# EAGLE design Strain Gauge Amplifier (EAGLE 7.1.0)
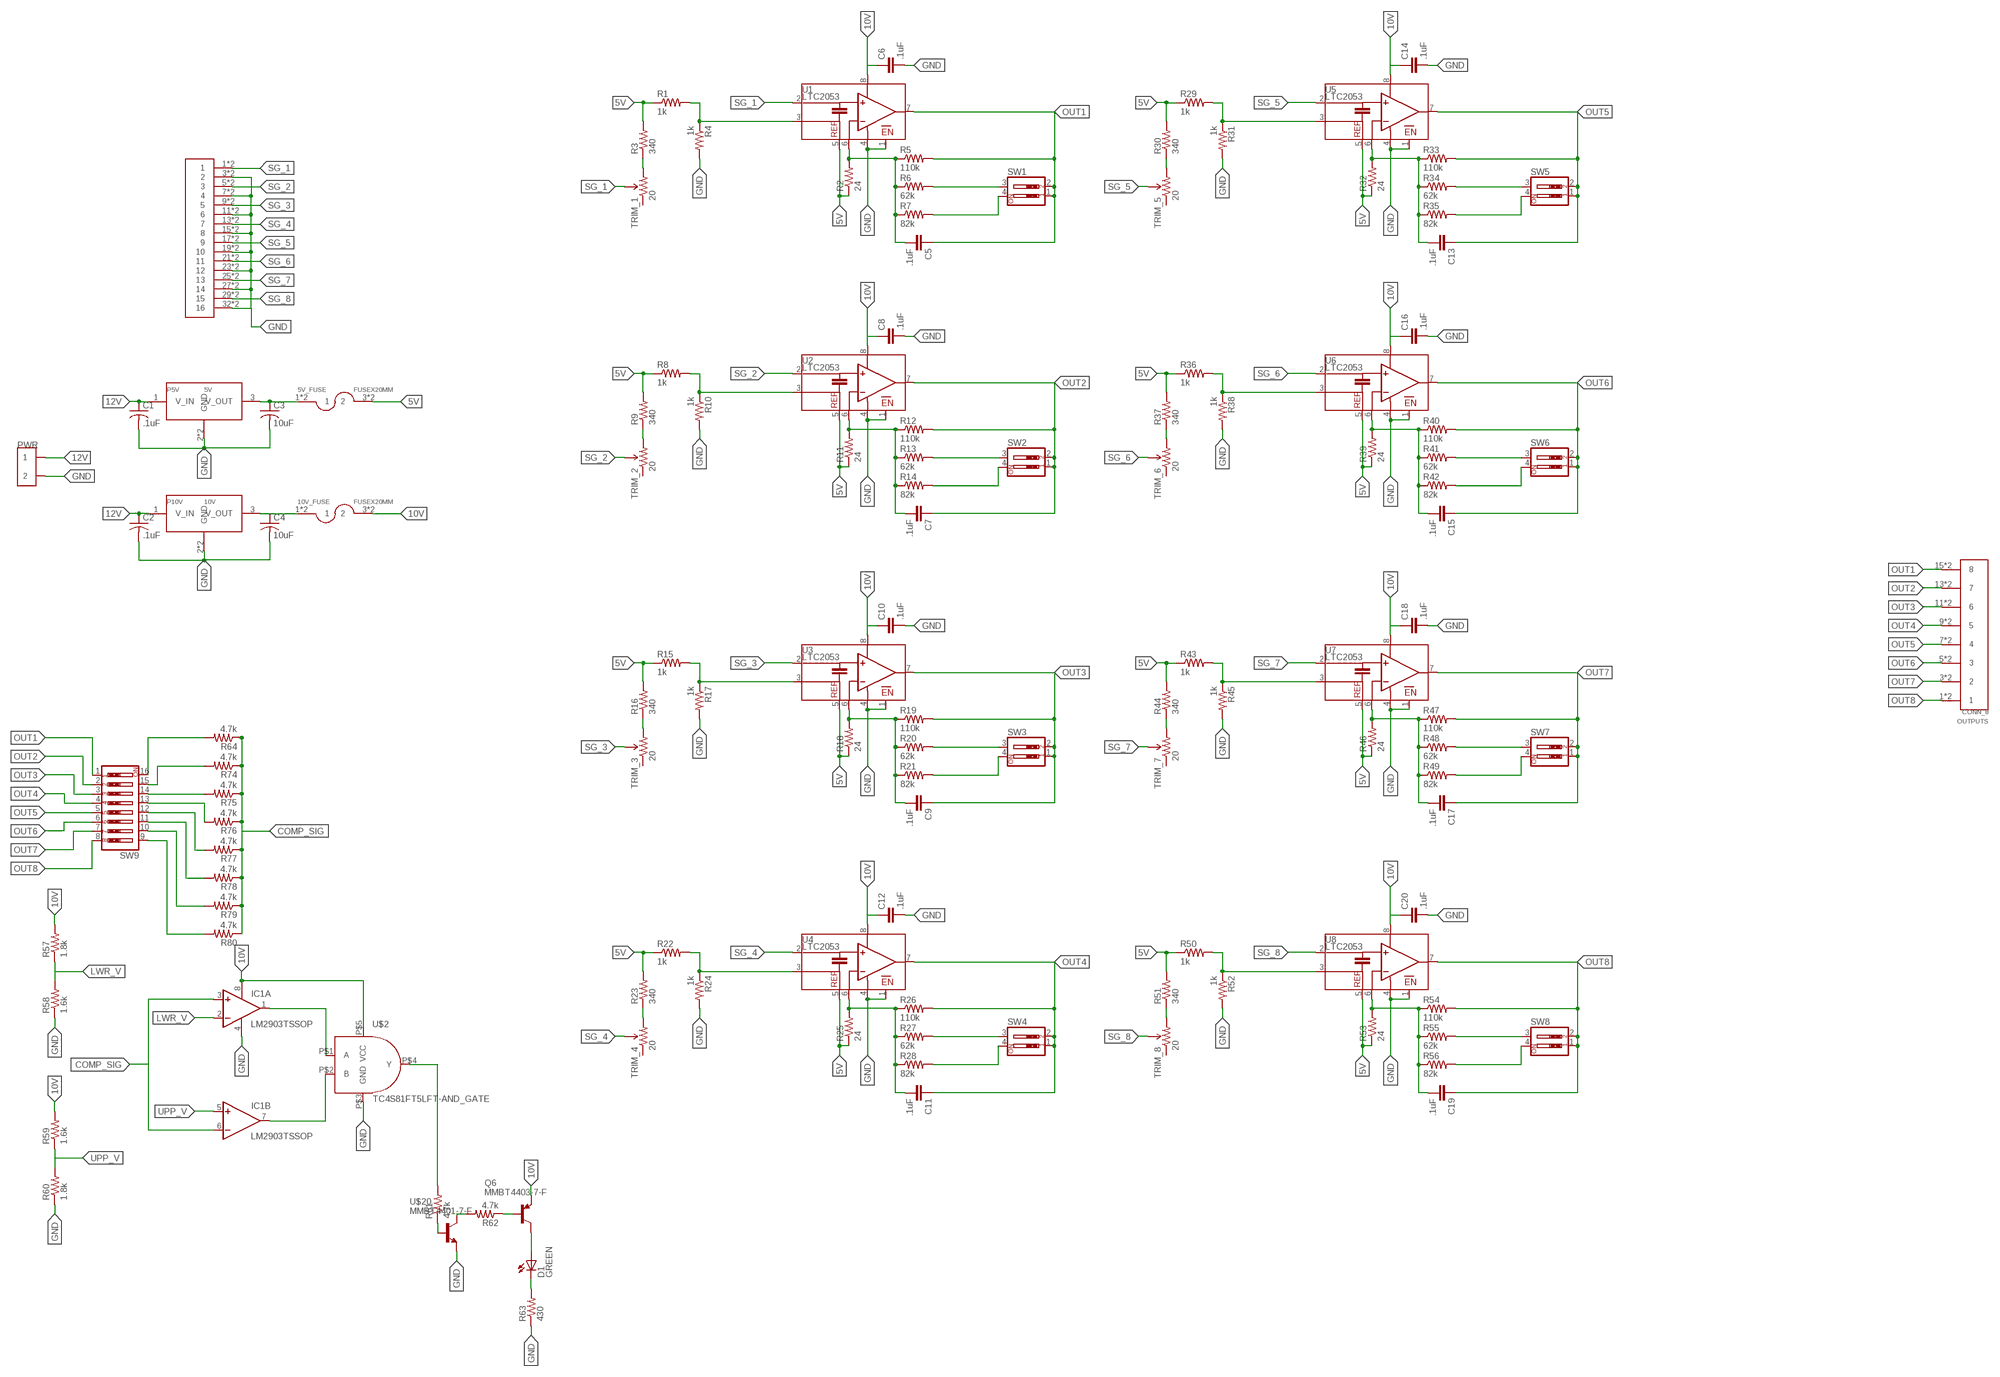
[diagram p0: schematic, sheet 1]

## Parts
5V_FUSE  FUSEX20MM  [FUSE_5MM]
10V_FUSE  FUSEX20MM  [FUSE_5MM]
C1  .1uF  C-USC0603  [C0603]
C2  .1uF  C-USC0603  [C0603]
C3  10uF  C-USC1206  [C1206]
C4  10uF  C-USC1206  [C1206]
C5  .1uF  CAP0603-CAP  [0603-CAP]
C6  .1uF  CAP0603-CAP  [0603-CAP]
C7  .1uF  CAP0603-CAP  [0603-CAP]
C8  .1uF  CAP0603-CAP  [0603-CAP]
C9  .1uF  CAP0603-CAP  [0603-CAP]
C10  .1uF  CAP0603-CAP  [0603-CAP]
C11  .1uF  CAP0603-CAP  [0603-CAP]
C12  .1uF  CAP0603-CAP  [0603-CAP]
C13  .1uF  CAP0603-CAP  [0603-CAP]
C14  .1uF  CAP0603-CAP  [0603-CAP]
C15  .1uF  CAP0603-CAP  [0603-CAP]
C16  .1uF  CAP0603-CAP  [0603-CAP]
C17  .1uF  CAP0603-CAP  [0603-CAP]
C18  .1uF  CAP0603-CAP  [0603-CAP]
C19  .1uF  CAP0603-CAP  [0603-CAP]
C20  .1uF  CAP0603-CAP  [0603-CAP]
D1  GREEN  LED-GREEN0603  [LED-0603]
IC1  LM2903TSSOP  [TSSOP8]
OUTPUTS  CONN_8  [CONNECTOR_8]
P5V  5V  LM2937  [SOT223]
P10V  10V  LM2937  [SOT223]
PWR  CONN_2  [CONNECTOR_2]
Q6  MMBT4403-7-F  [SOT-23-3]
R1  1k  RESISTOR0603  [0603-RES]
R2  24  RESISTOR0603  [0603-RES]
R3  340  RESISTOR0603  [0603-RES]
R4  1k  RESISTOR0603  [0603-RES]
R5  110k  RESISTOR0603  [0603-RES]
R6  62k  RESISTOR0603  [0603-RES]
R7  82k  RESISTOR0603  [0603-RES]
R8  1k  RESISTOR0603  [0603-RES]
R9  340  RESISTOR0603  [0603-RES]
R10  1k  RESISTOR0603  [0603-RES]
R11  24  RESISTOR0603  [0603-RES]
R12  110k  RESISTOR0603  [0603-RES]
R13  62k  RESISTOR0603  [0603-RES]
R14  82k  RESISTOR0603  [0603-RES]
R15  1k  RESISTOR0603  [0603-RES]
R16  340  RESISTOR0603  [0603-RES]
R17  1k  RESISTOR0603  [0603-RES]
R18  24  RESISTOR0603  [0603-RES]
R19  110k  RESISTOR0603  [0603-RES]
R20  62k  RESISTOR0603  [0603-RES]
R21  82k  RESISTOR0603  [0603-RES]
R22  1k  RESISTOR0603  [0603-RES]
R23  340  RESISTOR0603  [0603-RES]
R24  1k  RESISTOR0603  [0603-RES]
R25  24  RESISTOR0603  [0603-RES]
R26  110k  RESISTOR0603  [0603-RES]
R27  62k  RESISTOR0603  [0603-RES]
R28  82k  RESISTOR0603  [0603-RES]
R29  1k  RESISTOR0603  [0603-RES]
R30  340  RESISTOR0603  [0603-RES]
R31  1k  RESISTOR0603  [0603-RES]
R32  24  RESISTOR0603  [0603-RES]
R33  110k  RESISTOR0603  [0603-RES]
R34  62k  RESISTOR0603  [0603-RES]
R35  82k  RESISTOR0603  [0603-RES]
R36  1k  RESISTOR0603  [0603-RES]
R37  340  RESISTOR0603  [0603-RES]
R38  1k  RESISTOR0603  [0603-RES]
R39  24  RESISTOR0603  [0603-RES]
R40  110k  RESISTOR0603  [0603-RES]
R41  62k  RESISTOR0603  [0603-RES]
R42  82k  RESISTOR0603  [0603-RES]
R43  1k  RESISTOR0603  [0603-RES]
R44  340  RESISTOR0603  [0603-RES]
R45  1k  RESISTOR0603  [0603-RES]
R46  24  RESISTOR0603  [0603-RES]
R47  110k  RESISTOR0603  [0603-RES]
R48  62k  RESISTOR0603  [0603-RES]
R49  82k  RESISTOR0603  [0603-RES]
R50  1k  RESISTOR0603  [0603-RES]
R51  340  RESISTOR0603  [0603-RES]
R52  1k  RESISTOR0603  [0603-RES]
R53  24  RESISTOR0603  [0603-RES]
R54  110k  RESISTOR0603  [0603-RES]
R55  62k  RESISTOR0603  [0603-RES]
R56  82k  RESISTOR0603  [0603-RES]
R57  1.8k  RESISTOR0603  [0603-RES]
R58  1.6k  RESISTOR0603  [0603-RES]
R59  1.6k  RESISTOR0603  [0603-RES]
R60  1.8k  RESISTOR0603  [0603-RES]
R61  4.7k  RESISTOR0603  [0603-RES]
R62  4.7k  RESISTOR0603  [0603-RES]
R63  430  RESISTOR0603  [0603-RES]
R64  4.7k  RESISTOR0603  [0603-RES]
R74  4.7k  RESISTOR0603  [0603-RES]
R75  4.7k  RESISTOR0603  [0603-RES]
R76  4.7k  RESISTOR0603  [0603-RES]
R77  4.7k  RESISTOR0603  [0603-RES]
R78  4.7k  RESISTOR0603  [0603-RES]
R79  4.7k  RESISTOR0603  [0603-RES]
R80  4.7k  RESISTOR0603  [0603-RES]
SG_CONN  CONN_16  [CONNECTOR_16]
SW1  SW_DIP-2  [DIPSWITCH-02]
SW2  SW_DIP-2  [DIPSWITCH-02]
SW3  SW_DIP-2  [DIPSWITCH-02]
SW4  SW_DIP-2  [DIPSWITCH-02]
SW5  SW_DIP-2  [DIPSWITCH-02]
SW6  SW_DIP-2  [DIPSWITCH-02]
SW7  SW_DIP-2  [DIPSWITCH-02]
SW8  SW_DIP-2  [DIPSWITCH-02]
SW9  SW_DIP-8  [DIPSWITCH-08]
TRIM_1  20  3296Y  [3926_Y,Z]
TRIM_2  20  3296Y  [3926_Y,Z]
TRIM_3  20  3296Y  [3926_Y,Z]
TRIM_4  20  3296Y  [3926_Y,Z]
TRIM_5  20  3296Y  [3926_Y,Z]
TRIM_6  20  3296Y  [3926_Y,Z]
TRIM_7  20  3296Y  [3926_Y,Z]
TRIM_8  20  3296Y  [3926_Y,Z]
U1  LTC2053  [MSOP8]
U2  LTC2053  [MSOP8]
U3  LTC2053  [MSOP8]
U4  LTC2053  [MSOP8]
U5  LTC2053  [MSOP8]
U6  LTC2053  [MSOP8]
U7  LTC2053  [MSOP8]
U8  LTC2053  [MSOP8]
U$2  TC4S81FT5LFT-AND_GATE  [SSOP5-P-0.95]
U$20  MMBT4401-7-F  [SOT-23-3]

## Nets
5V: 5V_FUSE.3 5V_FUSE.4 R1.1 R2.1 R3.2 R8.1 R9.2 R11.1 R15.1 R16.2 R18.1 R22.1 R23.2 R25.1 R29.1 R30.2 R32.1 R36.1 R37.2 R39.1 R43.1 R44.2 R46.1 R50.1 R51.2 R53.1 U1.5(REF) U2.5(REF) U3.5(REF) U4.5(REF) U5.5(REF) U6.5(REF) U7.5(REF) U8.5(REF)
10V: 10V_FUSE.3 10V_FUSE.4 C6.1 C8.1 C10.1 C12.1 C14.1 C16.1 C18.1 C20.1 IC1.8(P:V+) Q6.P$3(E) R57.2 R59.2 U1.8(V+) U2.8(V+) U3.8(V+) U4.8(V+) U5.8(V+) U6.8(V+) U7.8(V+) U8.8(V+) U$2.P$5(VCC)
12V: C1.1 C2.1 P5V.1(V_IN) P10V.1(V_IN) PWR.1 PWR.2
COMP_SIG: IC1.3(A:+IN) IC1.6(B:-IN) R64.1 R74.1 R75.1 R76.1 R77.1 R78.1 R79.1 R80.1
GND: C1.2 C2.2 C3.2 C4.2 C6.2 C8.2 C10.2 C12.2 C14.2 C16.2 C18.2 C20.2 IC1.4(P:V-) P5V.2(GND) P5V.4(GND) P10V.2(GND) P10V.4(GND) PWR.3 PWR.4 R4.2 R10.2 R17.2 R24.2 R31.2 R38.2 R45.2 R52.2 R58.1 R60.1 R63.1 SG_CONN.3 SG_CONN.4 SG_CONN.7 SG_CONN.8 SG_CONN.11 SG_CONN.12 SG_CONN.15 SG_CONN.16 SG_CONN.19 SG_CONN.20 SG_CONN.23 SG_CONN.24 SG_CONN.27 SG_CONN.28 SG_CONN.32 SG_CONN.P31 U1.1(EN) U1.4(V-) U2.1(EN) U2.4(V-) U3.1(EN) U3.4(V-) U4.1(EN) U4.4(V-) U5.1(EN) U5.4(V-) U6.1(EN) U6.4(V-) U7.1(EN) U7.4(V-) U8.1(EN) U8.4(V-) U$2.P$3(GND) U$20.P$3(E)
LWR_V: IC1.2(A:-IN) R57.1 R58.2
N$1: C5.2 R2.2 R5.1 R6.1 R7.1 U1.6(RG)
N$2: 5V_FUSE.1 5V_FUSE.2 C3.1 P5V.3(V_OUT)
N$3: 10V_FUSE.1 10V_FUSE.2 C4.1 P10V.3(V_OUT)
N$4: R1.2 R4.1 U1.3(+IN)
N$5: IC1.1(A:OUT) U$2.P$1(A)
N$6: R3.1 TRIM_1.3(CW)
N$7: R6.2 SW1.3
N$8: R7.2 SW1.4
N$9: R8.2 R10.1 U2.3(+IN)
N$10: C7.2 R11.2 R12.1 R13.1 R14.1 U2.6(RG)
N$11: IC1.7(B:OUT) U$2.P$2(B)
N$12: R9.1 TRIM_2.3(CW)
N$13: R13.2 SW2.3
N$14: R14.2 SW2.4
N$15: R15.2 R17.1 U3.3(+IN)
N$16: C9.2 R18.2 R19.1 R20.1 R21.1 U3.6(RG)
N$17: R61.1 U$20.P$2(B)
N$18: R16.1 TRIM_3.3(CW)
N$19: R20.2 SW3.3
N$20: R21.2 SW3.4
N$21: R22.2 R24.1 U4.3(+IN)
N$22: C11.2 R25.2 R26.1 R27.1 R28.1 U4.6(RG)
N$23: R62.2 U$20.P$1(C)
N$24: R23.1 TRIM_4.3(CW)
N$25: R27.2 SW4.3
N$26: R28.2 SW4.4
N$27: R29.2 R31.1 U5.3(+IN)
N$28: C13.2 R32.2 R33.1 R34.1 R35.1 U5.6(RG)
N$29: Q6.P$2(B) R62.1
N$30: R30.1 TRIM_5.3(CW)
N$31: R34.2 SW5.3
N$32: R35.2 SW5.4
N$33: R36.2 R38.1 U6.3(+IN)
N$34: C15.2 R39.2 R40.1 R41.1 R42.1 U6.6(RG)
N$35: R61.2 U$2.P$4(Y)
N$36: R37.1 TRIM_6.3(CW)
N$37: R41.2 SW6.3
N$38: R42.2 SW6.4
N$39: R43.2 R45.1 U7.3(+IN)
N$40: C17.2 R46.2 R47.1 R48.1 R49.1 U7.6(RG)
N$41: D1.A Q6.P$1(C)
N$42: R44.1 TRIM_7.3(CW)
N$43: R48.2 SW7.3
N$44: R49.2 SW7.4
N$45: R50.2 R52.1 U8.3(+IN)
N$46: C19.2 R53.2 R54.1 R55.1 R56.1 U8.6(RG)
N$47: D1.C R63.2
N$48: R51.1 TRIM_8.3(CW)
N$49: R55.2 SW8.3
N$50: R56.2 SW8.4
N$65: R64.2 SW9.16
N$66: R74.2 SW9.15
N$67: R75.2 SW9.14
N$68: R76.2 SW9.13
N$69: R77.2 SW9.12
N$70: R78.2 SW9.11
N$73: R79.2 SW9.10
N$74: R80.2 SW9.9
OUT1: C5.1 OUTPUTS.15 OUTPUTS.16 R5.2 SW1.1 SW1.2 SW9.1 U1.7(OUT)
OUT2: C7.1 OUTPUTS.13 OUTPUTS.14 R12.2 SW2.1 SW2.2 SW9.2 U2.7(OUT)
OUT3: C9.1 OUTPUTS.11 OUTPUTS.12 R19.2 SW3.1 SW3.2 SW9.3 U3.7(OUT)
OUT4: C11.1 OUTPUTS.9 OUTPUTS.10 R26.2 SW4.1 SW4.2 SW9.4 U4.7(OUT)
OUT5: C13.1 OUTPUTS.7 OUTPUTS.8 R33.2 SW5.1 SW5.2 SW9.5 U5.7(OUT)
OUT6: C15.1 OUTPUTS.5 OUTPUTS.6 R40.2 SW6.1 SW6.2 SW9.6 U6.7(OUT)
OUT7: C17.1 OUTPUTS.3 OUTPUTS.4 R47.2 SW7.1 SW7.2 SW9.7 U7.7(OUT)
OUT8: C19.1 OUTPUTS.1 OUTPUTS.2 R54.2 SW8.1 SW8.2 SW9.8 U8.7(OUT)
SG_1: SG_CONN.1 SG_CONN.2 TRIM_1.2(WIPER) U1.2(-IN)
SG_2: SG_CONN.5 SG_CONN.6 TRIM_2.2(WIPER) U2.2(-IN)
SG_3: SG_CONN.9 SG_CONN.10 TRIM_3.2(WIPER) U3.2(-IN)
SG_4: SG_CONN.13 SG_CONN.14 TRIM_4.2(WIPER) U4.2(-IN)
SG_5: SG_CONN.17 SG_CONN.18 TRIM_5.2(WIPER) U5.2(-IN)
SG_6: SG_CONN.21 SG_CONN.22 TRIM_6.2(WIPER) U6.2(-IN)
SG_7: SG_CONN.25 SG_CONN.26 TRIM_7.2(WIPER) U7.2(-IN)
SG_8: SG_CONN.29 SG_CONN.30 TRIM_8.2(WIPER) U8.2(-IN)
UPP_V: IC1.5(B:+IN) R59.1 R60.2
Unconnected: TRIM_1.1(CCW) TRIM_2.1(CCW) TRIM_3.1(CCW) TRIM_4.1(CCW) TRIM_5.1(CCW) TRIM_6.1(CCW) TRIM_7.1(CCW) TRIM_8.1(CCW)

## Library data of the parts
5V_FUSE 10V_FUSE = SparkFun-Passives:FUSE
C1-C4 = resistor:C-US: CAPACITOR, American symbol
C5-C20 = SparkFun-Passives:CAP: Capacitor Standard 0603 ceramic capacitor, and 0.1" leaded capacitor.
D1 = SparkFun-LED:LED-GREEN: Various green LEDs 0603- DIO-00821 LARGE- DIO-00862 LILYPAD- DIO-09910; PROD_ID: DIO-00821
IC1 = linear:LM2903: COMPARATOR
OUTPUTS = formula electric:CONN_8
P5V P10V = texas:LM2937
PWR = formula electric:CONN_2
Q6 = formula electric:MMBT4403-7-F
R1-R64 R74-R80 = SparkFun-Resistors:RESISTOR: Resistor Basic schematic elements and footprints for 0603, 1206, and PTH resistors.
SG_CONN = formula electric:CONN_16
SW1-SW8 = SparkFun-Electromechanical:SW_DIP-2: DIP SWITCH
SW9 = SparkFun-Electromechanical:SW_DIP-8: DIP Switch 8 Position Spark Fun Electronics SKU : COM-08034
TRIM_1-TRIM_8 = bourns:3296Y: Trimpot
U1-U8 = linear-technology:LTC2053: DK: LTC2053CMS8#PBF-ND
U$2 = formula electric:TC4S81FT5LFT-AND_GATE: TC4S81FT5LFTCT-ND
U$20 = formula electric:MMBT4401-7-F

## Board
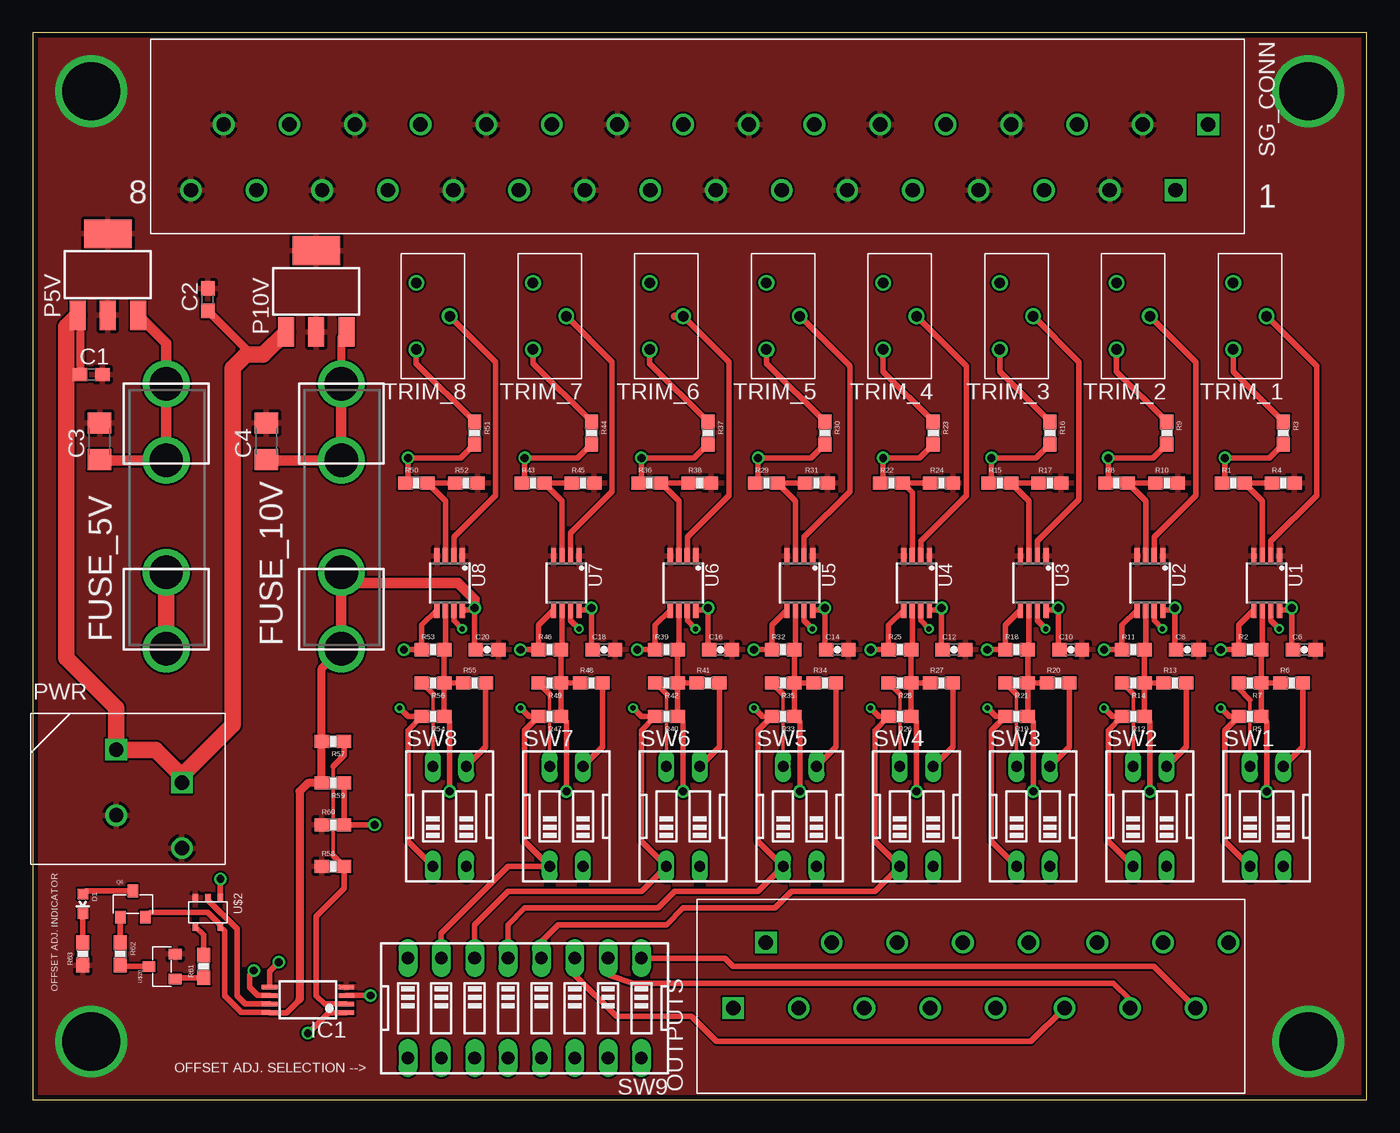
[diagram p1: board, top side]
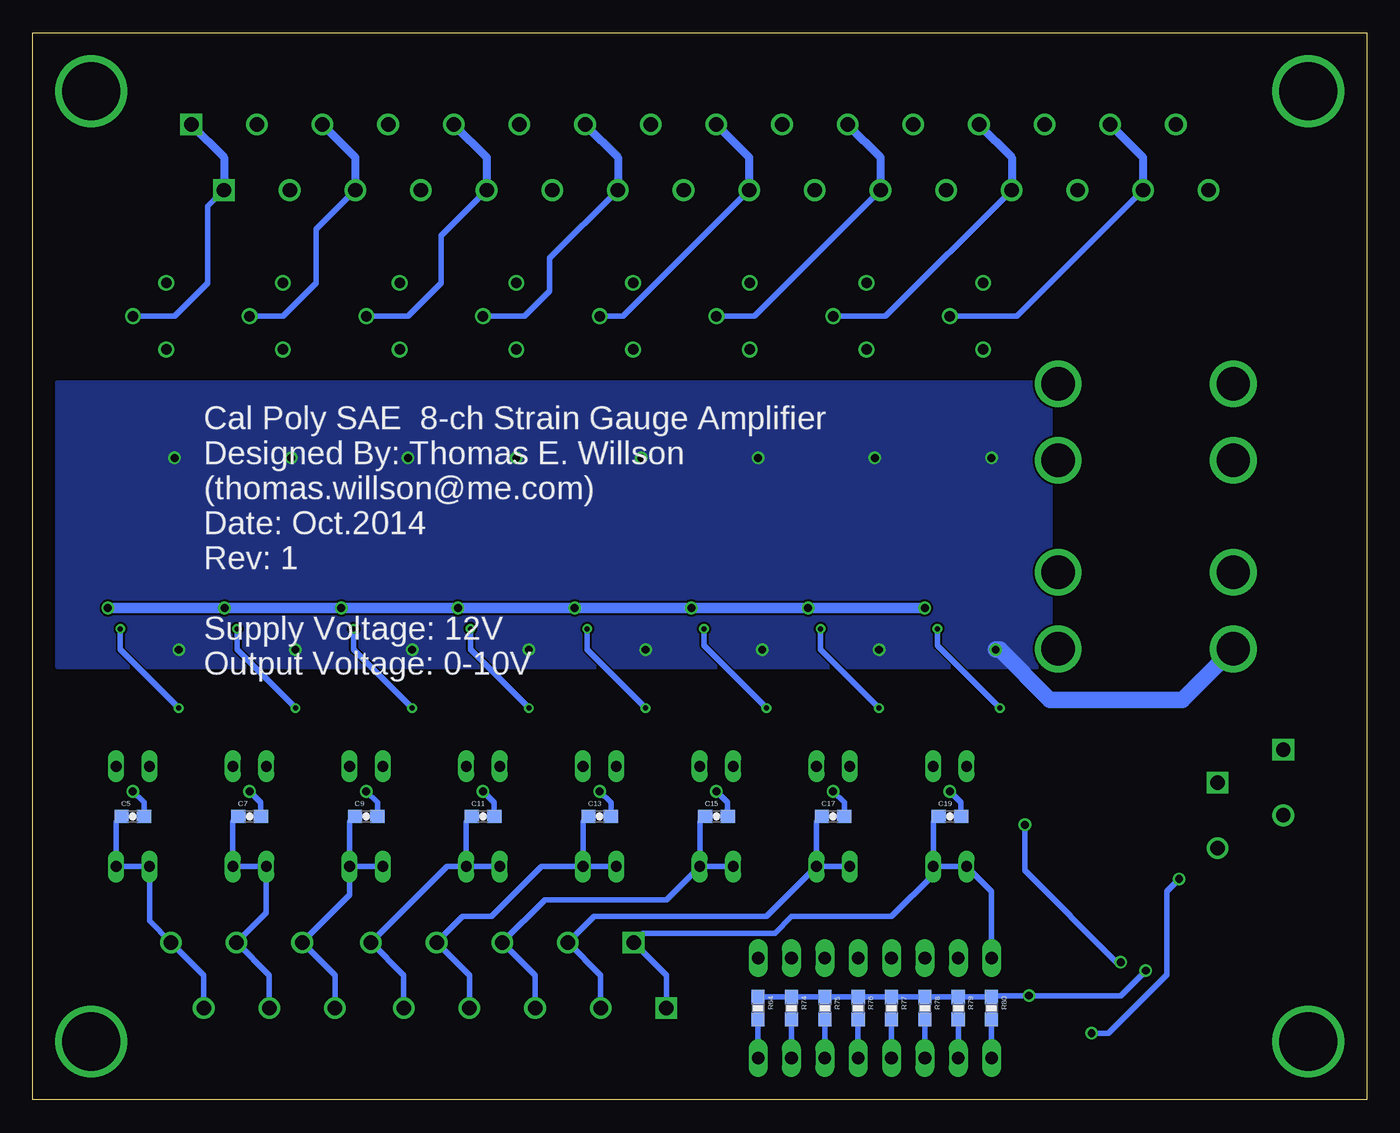
[diagram p2: board, bottom side, seen from below]

Size 101.6 x 81.28 mm. Coordinates in mm from the lower left corner, seen from the top.
Outline: 0,0 101.6,0 101.6,81.28 0,81.28 0,0
Copper layers (1*16): Top 0.0356mm / dielectric 1.5011mm / Bottom 0.0356mm
Design rules "OshPark DRC *": minimum track width 6mil, minimum drill 13mil, track to track 6mil, track to pad 6mil, pad to pad 6mil, via to via 6mil, smd to smd 6mil, copper to edge 15mil, drill to drill 6mil, minimum pad ring 7mil, minimum via ring 7mil, stop-mask expansion 3mil, vias tented up to drill 25mil, thermal gap 10mil

### Footprints (pad centres in the part's own frame; a part is rotated, then mirrored left to right if it is on the bottom)
FUSE_5MM = drill 2.54 pad 3.556: 1 0,-10.1; 2 0,-4.258; 3 0,4.258; 4 0,10.1
C0603 = smd 1.1 x 1: 1 -0.85,0; 2 0.85,0
C1206 = smd 1.6 x 1.8: 1 -1.4,0; 2 1.4,0
0603-CAP = smd 1.1 x 1: 1 -0.85,0; 2 0.85,0
LED-0603 = smd 0.8 x 0.8: A 0,-0.75; C 0,0.75
TSSOP8 = smd 0.35 x 1.2: 1 -0.975,-2.925; 2 -0.325,-2.925; 3 0.325,-2.925; 4 0.975,-2.925; 5 0.975,2.925; 6 0.325,2.925; 7 -0.325,2.925; 8 -0.975,2.925
CONNECTOR_8 = drill 1.1 square: 1 -2.54,-5.08; 2 -0.04,-0.08 | drill 1.1: 3 2.46,-5.08; 4 4.96,-0.08; 5 7.46,-5.08; 6 9.96,-0.08; 7 12.46,-5.08; 8 14.96,-0.08; 9 17.46,-5.08; 10 19.96,-0.08; 11 22.7,-5.08; 12 25.2,-0.08; 13 27.7,-5.08; 14 30.2,-0.08; 15 32.7,-5.08; 16 35.2,-0.08
SOT223 = smd 1.219 x 2.235: 1 -2.311,-3.099; 2 0,-3.099; 3 2.311,-3.099 | smd 3.6 x 2.2: 4 0,3.099
CONNECTOR_2 = drill 1.1 square: 1 0,0; 2 2.5,5 | drill 1.1: 3 5,0; 4 7.5,5
SOT-23-3 = smd 0.8 x 0.976: P$1 0,1; P$2 -0.95,-1; P$3 0.95,-1
0603-RES = smd 1.1 x 1: 1 -0.85,0; 2 0.85,0
CONNECTOR_16 = drill 1.1 square: 1 0,0; 2 2.5,5 | drill 1.1: 3 5,0; 4 7.5,5; 5 10,0; 6 12.5,5; 7 15,0; 8 17.5,5; 9 20,0; 10 22.5,5; 11 25,0; 12 27.5,5; 13 30,0; 14 32.5,5; 15 35,0; 16 37.5,5; 17 40,0; 18 42.5,5; 19 45,0; 20 47.5,5; 21 50,0; 22 52.5,5; 23 55,0; 24 57.5,5; 25 60,0; 26 62.5,5; 27 65,0; 28 67.5,5; 29 70,0; 30 72.5,5; 32 77.5,5; P31 75,0
DIPSWITCH-02 = drill 0.813 long: 1 -1.27,-3.81; 2 1.27,-3.81; 3 1.27,3.81; 4 -1.27,3.81
DIPSWITCH-08 = drill 0.97 long: 1 -8.89,-3.81; 2 -6.35,-3.81; 3 -3.81,-3.81; 4 -1.27,-3.81; 5 1.27,-3.81; 6 3.81,-3.81; 7 6.35,-3.81; 8 8.89,-3.81; 9 8.89,3.81; 10 6.35,3.81; 11 3.81,3.81; 12 1.27,3.81; 13 -1.27,3.81; 14 -3.81,3.81; 15 -6.35,3.81; 16 -8.89,3.81
3926_Y,Z = drill 0.8: 1 1.27,-2.54; 2 -1.27,0; 3 1.27,2.54
MSOP8 = smd 0.4 x 1.2: 1 -0.975,-2.05; 2 -0.325,-2.05; 3 0.325,-2.05; 4 0.975,-2.05; 5 0.975,2.05; 6 0.325,2.05; 7 -0.325,2.05; 8 -0.975,2.05
SSOP5-P-0.95 = smd 0.6 x 0.4: P$1 -1.1,0.95; P$2 -1.1,0; P$3 -1.1,-0.95; P$4 1.1,-0.95; P$5 1.1,0.95

### Placement (x,y rotation side)
5V_FUSE  10.16,44.45 180 top
10V_FUSE  23.5,44.45 180 top
C1  4.45,55.24 0 top
C2  13.34,60.96 90 top
C3  5.08,50.16 90 top
C4  17.78,50.16 90 top
C5  93.98,21.59 0 bottom
C6  96.84,34.29 0 top
C7  85.09,21.59 0 bottom
C8  87.95,34.29 0 top
C9  76.2,21.59 0 bottom
C10  79.06,34.29 0 top
C11  67.31,21.59 0 bottom
C12  70.17,34.29 0 top
C13  58.42,21.59 0 bottom
C14  61.28,34.29 0 top
C15  49.53,21.59 0 bottom
C16  52.39,34.29 0 top
C17  40.64,21.59 0 bottom
C18  43.5,34.29 0 top
C19  31.75,21.59 0 bottom
C20  34.61,34.29 0 top
D1  3.81,14.92 180 top
IC1  20.95,7.62 90 top
OUTPUTS  55.88,12.06 0 top
P5V  5.71,62.87 0 top
P10V  21.59,61.59 0 top
PWR  6.35,26.67 270 top
Q6  7.62,14.92 0 top
R1  91.44,46.99 0 top
R2  92.71,34.29 0 top
R3  95.25,50.8 270 top
R4  95.25,46.99 0 top
R5  92.71,29.21 180 top
R6  95.89,31.75 0 top
R7  92.71,31.75 180 top
R8  82.55,46.99 0 top
R9  86.36,50.8 270 top
R10  86.36,46.99 0 top
R11  83.82,34.29 0 top
R12  83.82,29.21 180 top
R13  87,31.75 0 top
R14  83.82,31.75 180 top
R15  73.66,46.99 0 top
R16  77.47,50.8 270 top
R17  77.47,46.99 0 top
R18  74.93,34.29 0 top
R19  74.93,29.21 180 top
R20  78.11,31.75 0 top
R21  74.93,31.75 180 top
R22  65.41,46.99 0 top
R23  68.58,50.8 270 top
R24  69.22,46.99 0 top
R25  66.04,34.29 0 top
R26  66.04,29.21 180 top
R27  69.22,31.75 0 top
R28  66.04,31.75 180 top
R29  55.88,46.99 0 top
R30  60.33,50.8 270 top
R31  59.69,46.99 0 top
R32  57.15,34.29 0 top
R33  57.15,29.21 180 top
R34  60.33,31.75 0 top
R35  57.15,31.75 180 top
R36  46.99,46.99 0 top
R37  51.44,50.8 270 top
R38  50.8,46.99 0 top
R39  48.26,34.29 0 top
R40  48.26,29.21 180 top
R41  51.44,31.75 0 top
R42  48.26,31.75 180 top
R43  38.1,46.99 0 top
R44  42.55,50.8 270 top
R45  41.91,46.99 0 top
R46  39.37,34.29 0 top
R47  39.37,29.21 180 top
R48  42.55,31.75 0 top
R49  39.37,31.75 180 top
R50  29.21,46.99 0 top
R51  33.66,50.8 270 top
R52  33.02,46.99 0 top
R53  30.48,34.29 0 top
R54  30.48,29.21 180 top
R55  33.66,31.75 0 top
R56  30.48,31.75 180 top
R57  22.86,27.3 180 top
R58  22.86,17.78 0 top
R59  22.86,24.13 180 top
R60  22.86,20.95 0 top
R61  13.02,10.16 90 top
R62  6.67,11.11 270 top
R63  3.81,11.11 90 top
R64  46.35,6.99 270 bottom
R74  43.81,6.99 270 bottom
R75  41.27,6.99 270 bottom
R76  38.73,6.99 270 bottom
R77  36.2,6.99 270 bottom
R78  33.66,6.99 270 bottom
R79  31.11,6.99 270 bottom
R80  28.57,6.99 270 bottom
SG_CONN  89.53,74.3 180 top
SW1  93.98,21.59 0 top
SW2  85.09,21.59 0 top
SW3  76.2,21.59 0 top
SW4  67.31,21.59 0 top
SW5  58.42,21.59 0 top
SW6  49.53,21.59 0 top
SW7  40.64,21.59 0 top
SW8  31.75,21.59 0 top
SW9  37.47,6.99 180 top
TRIM_1  92.71,59.69 180 top
TRIM_2  83.82,59.69 180 top
TRIM_3  74.93,59.69 180 top
TRIM_4  66.04,59.69 180 top
TRIM_5  57.15,59.69 180 top
TRIM_6  48.26,59.69 180 top
TRIM_7  39.37,59.69 180 top
TRIM_8  30.48,59.69 180 top
U1  93.98,39.37 180 top
U2  85.09,39.37 180 top
U3  76.2,39.37 180 top
U4  67.31,39.37 180 top
U5  58.42,39.37 180 top
U6  49.53,39.37 180 top
U7  40.64,39.37 180 top
U8  31.75,39.37 180 top
U$2  13.34,14.29 270 top
U$20  9.84,10.16 90 top

### Tracks (layer width: path | path; a pad name or v marks a point on that pad's centre or on a via)
5V  (via drill 0.6)
  Top 0.406: R43.1 37.47,47.2 v37.47,48.9 41.49,48.9 R44.2 | R36.1 46.35,47.2 v46.35,48.9 50.38,48.9 R37.2 | R29.1 55.24,47.2 v55.24,48.9 59.27,48.9 R30.2 | R22.1 64.77,47.2 v64.77,48.9 67.53,48.9 R23.2 | R15.1 73.03,47.2 v73.03,48.9 76.42,48.9 R16.2 | R8.1 81.92,47.2 v81.92,48.9 85.31,48.9 R9.2 | R1.1 90.81,47.2 v90.81,48.9 94.19,48.9 R3.2 | R53.1 29.63,36.17 U8.5 | R46.1 38.52,36.17 U7.5 | U6.5 47.41,36.17 R39.1 47.62,34.29 | U5.5 56.3,36.17 R32.1 56.52,34.29 | U4.5 65.19,36.17 R25.1 65.41,34.29 | U3.5 74.08,36.17 R18.1 74.3,34.29 | U2.5 82.97,36.17 R11.1 83.19,34.29 | U1.5 91.86,36.17 R2.1 92.08,34.29 | 29.21,34.29 v28.26,34.29 | 38.1,34.29 v37.15,34.29 | 46.99,34.29 v46.04,34.29 | 56.2,34.29 v54.93,34.29 | 65.09,34.29 v63.82,34.29 | 73.98,34.29 v72.71,34.29 | 82.87,34.29 v81.6,34.29 | 91.76,34.29 v90.49,34.29 | R51.2 32.6,48.9 v28.57,48.9 28.57,46.99 R50.1
  Top 0.61: 29.21,34.29 R53.1 | 38.1,34.29 R46.1 | R39.1 46.99,34.29 | R32.1 56.2,34.29 | R25.1 65.09,34.29 | R18.1 73.98,34.29 | R11.1 82.87,34.29 | R2.1 91.76,34.29
  Top 1.27: 5V_FUSE.4 5V_FUSE.3
  Bottom 1.27: 5V_FUSE.4 14.03,30.48 24.13,30.48 27.94,34.29 v28.26,34.29
  pour Bottom: 24.13,54.61 99.69,54.61 99.69,33.02 24.13,33.02
10V  (via drill 0.6)
  Top 0.406: U8.8 33.51,37.32 v33.66,37.47 33.66,34.39 C20.1 | U7.8 42.4,37.32 v42.55,37.47 42.55,34.39 C18.1 | U6.8 51.29,37.32 v51.44,37.47 51.44,34.39 C16.1 | U5.8 60.18,37.32 v60.33,37.47 60.33,34.39 C14.1 | U4.8 69.07,37.32 v69.22,37.47 69.22,34.39 C12.1 | U3.8 77.96,37.32 v78.11,37.47 78.11,34.39 C10.1 | U2.8 86.85,37.32 v87,37.47 87,34.39 C8.1 | U1.8 95.74,37.32 v95.89,37.47 95.89,34.39 C6.1 | 20.32,7.62 19.34,6.64 IC1.8 18.01,6.67 15.88,6.67 14.61,7.94 14.61,12.87 U$2.P$5 14.29,13.34 13.34,14.29 8.94,14.29 Q6.P$3
  Top 0.61: 10V_FUSE.4 22.01,32.87 R57.2 R59.2 20.95,24.13 20.32,23.5 20.32,7.62
  Top 0.813: v33.66,37.47 33.66,38.1 32.38,39.37 24.32,39.37 10V_FUSE.3 10V_FUSE.4
  Bottom 0.813: v33.66,37.47 v42.55,37.47 v51.44,37.47 v60.33,37.47 v69.22,37.47 v78.11,37.47 v87,37.47 v95.89,37.47
12V
  Top 0.61: C2.1 16.27,57.18 16.27,56.76 | P5V.1 3.6,59.58 C1.1
  Top 1.27: 11.35,24.68 15.24,28.57 15.24,55.73 16.27,56.76 17.54,56.76 P10V.1 | 11.35,24.68 PWR.2 | 11.35,24.68 9.37,26.67 PWR.1 6.35,29.84 2.54,33.66 2.54,58.9 P5V.1
COMP_SIG  (via drill 0.6)
  Top 0.406: IC1.3 v25.71,7.95 v25.72,7.94 | IC1.6 17.14,7.95 16.51,8.57 16.51,9.53 v16.83,9.84
  Bottom 0.406: R64.1 R74.1 R75.1 R76.1 R77.1 R78.1 R79.1 R80.1 28.47,7.94 v25.72,7.94 18.73,7.94 v16.83,9.84
GND  (via drill 4.45)
  other vias: 4.45,76.83 97.16,76.83 97.16,4.45 4.45,4.45
  pour Top: 0,81.28 101.6,81.28 101.6,0 0,0
LWR_V
  Top 0.254: 22.86,18.63 22.86,25.4
  Top 0.406: IC1.2 22.23,7.29 21.59,7.94 21.59,13.97 23.71,16.09 R58.2 22.86,18.63 | 22.86,25.4 23.71,26.25 R57.1
N$1  (via drill 0.6)
  Top 0.406: R6.1 R7.1 | U1.6 93.66,34.38 R2.2 R7.1 | R7.1 R5.1 93.98,28.79 v93.98,23.5
  Bottom 0.406: v93.98,23.5 93.13,22.64 C5.2
N$2
  Top 0.813: P5V.3 10.16,57.63 5V_FUSE.1 5V_FUSE.2 5.77,48.71 C3.1
N$3
  Top 0.61: P10V.3 23.5,58.09 10V_FUSE.1
  Top 0.813: 10V_FUSE.1 10V_FUSE.2 18.47,48.71 C4.1
N$4
  Top 0.406: R4.1 R1.2 93.66,45.62 U1.3
N$5  (via drill 0.6)
  Top 0.406: IC1.1 22.52,6.64 v20.95,5.08 | v14.29,16.83 U$2.P$1
  Bottom 0.406: v20.95,5.08 19.68,5.08 15.24,9.53 15.24,15.88 v14.29,16.83
N$6
  Top 0.406: TRIM_1.3 91.44,55.46 R3.1
N$7
  Top 0.406: R6.2 96.73,26.89 SW1.3
N$8
  Top 0.254: 92.71,30.48 SW1.4
  Top 0.406: R7.2 91.86,31.33 92.71,30.48
N$9
  Top 0.406: R10.1 R8.2 84.77,45.62 U2.3
N$10  (via drill 0.6)
  Top 0.406: R13.1 R14.1 | U2.6 84.77,34.38 R11.2 R14.1 | R14.1 R12.1 85.09,28.79 v85.09,23.5
  Bottom 0.406: v85.09,23.5 84.24,22.64 C7.2
N$11
  Top 0.406: U$2.P$2 13.34,15.24 15.56,13.02 15.56,7.94 16.19,7.3 18.02,7.3 IC1.7
N$12
  Top 0.406: TRIM_2.3 82.55,55.46 R9.1
N$13
  Top 0.406: R13.2 87.84,26.89 SW2.3
N$14
  Top 0.254: 83.82,30.9 SW2.4
  Top 0.406: R14.2 83.82,30.9
N$15
  Top 0.406: R17.1 R15.2 75.88,45.62 U3.3
N$16  (via drill 0.6)
  Top 0.406: R20.1 R21.1 | U3.6 75.88,34.38 R18.2 R21.1 | R21.1 R19.1 76.2,28.79 v76.2,23.5
  Bottom 0.406: v76.2,23.5 75.35,22.64 C9.2
N$17
  Top 0.406: U$20.P$2 10.94,9.31 R61.1
N$18
  Top 0.406: TRIM_3.3 73.66,55.46 R16.1
N$19
  Top 0.406: R20.2 78.95,26.89 SW3.3
N$20
  Top 0.254: 74.93,30.9 SW3.4
  Top 0.406: R21.2 74.93,30.9
N$21
  Top 0.406: R24.1 R22.2 66.98,46.26 U4.3
N$22  (via drill 0.6)
  Top 0.406: R27.1 R28.1 | U4.6 66.98,34.38 R25.2 R28.1 | R28.1 R26.1 67.31,28.79 v67.31,23.5
  Bottom 0.406: v67.31,23.5 66.46,22.64 C11.2
N$23
  Top 0.406: R62.2 6.77,10.16 U$20.P$1
N$24
  Top 0.406: TRIM_4.3 64.77,55.46 R23.1
N$25
  Top 0.406: R27.2 70.06,26.89 SW4.3
N$26
  Top 0.254: 66.04,30.9 SW4.4
  Top 0.406: R28.2 66.04,30.9
N$27
  Top 0.406: R31.1 R29.2 58.09,45.62 U5.3
N$28  (via drill 0.6)
  Top 0.406: R34.1 R35.1 | U5.6 58.09,34.38 R32.2 R35.1 | R35.1 R33.1 58.42,28.79 v58.42,23.5
  Bottom 0.406: v58.42,23.5 57.57,22.64 C13.2
N$29
  Top 0.406: Q6.P$2 R62.1
N$30
  Top 0.406: TRIM_5.3 55.88,56.09 R30.1
N$31
  Top 0.406: R34.2 61.17,26.89 SW5.3
N$32
  Top 0.254: 57.15,30.9 SW5.4
  Top 0.406: R35.2 57.15,30.9
N$33
  Top 0.406: R38.1 R36.2 49.2,45.62 U6.3
N$34  (via drill 0.6)
  Top 0.406: R41.1 R42.1 | U6.6 49.2,34.38 R39.2 R42.1 | R42.1 R40.1 49.53,28.79 v49.53,23.5
  Bottom 0.406: v49.53,23.5 48.68,22.64 C15.2
N$35
  Top 0.406: U$2.P$4 13.02,12.55 R61.2
N$36
  Top 0.406: TRIM_6.3 46.99,56.09 R37.1
N$37
  Top 0.406: R41.2 52.28,26.89 SW6.3
N$38
  Top 0.254: 48.26,30.9 SW6.4
  Top 0.406: R42.2 48.26,30.9
N$39
  Top 0.406: R45.1 R43.2 40.31,45.62 U7.3
N$40  (via drill 0.6)
  Top 0.406: R48.1 R49.1 | U7.6 40.31,34.38 R46.2 R49.1 | R49.1 R47.1 40.64,28.79 v40.64,23.5
  Bottom 0.406: v40.64,23.5 39.79,22.64 C17.2
N$41
  Top 0.406: D1.A 4.06,15.92 Q6.P$1
N$42
  Top 0.406: TRIM_7.3 38.1,56.09 R44.1
N$43
  Top 0.406: R48.2 43.4,26.89 SW7.3
N$44
  Top 0.254: 39.37,30.9 SW7.4
  Top 0.406: R49.2 39.37,30.9
N$45
  Top 0.406: R52.1 R50.2 31.43,45.62 U8.3
N$46  (via drill 0.6)
  Top 0.406: R55.1 R56.1 | U8.6 31.43,34.38 R53.2 R56.1 | R56.1 R54.1 31.75,28.79 v31.75,23.5
  Bottom 0.406: v31.75,23.5 30.9,22.64 C19.2
N$47
  Top 0.406: D1.C R63.2
N$48
  Top 0.406: TRIM_8.3 29.21,56.09 R51.1
N$49
  Top 0.406: R55.2 34.51,26.89 SW8.3
N$50
  Top 0.254: 30.48,30.9 SW8.4
  Top 0.406: R56.2 30.48,30.9
N$65
  Bottom 0.406: R64.2 SW9.16
N$66
  Bottom 0.406: R74.2 SW9.15
N$67
  Bottom 0.406: SW9.14 R75.2
N$68
  Bottom 0.406: SW9.13 R76.2
N$69
  Bottom 0.406: SW9.12 R77.2
N$70
  Bottom 0.406: SW9.11 R78.2
N$73
  Bottom 0.406: SW9.10 R79.2
N$74
  Bottom 0.406: SW9.9 R80.2
OUT1  (via drill 0.38)
  Top 0.406: SW1.1 90.81,19.68 90.81,28.16 R5.2 91.12,29.21 v90.49,29.84 | U1.7 94.31,36.51 v94.93,35.88 | SW9.1 52.7,10.79 53.34,10.16 85.41,10.16 OUTPUTS.15
  Bottom 0.406: OUTPUTS.15 88.58,9.48 OUTPUTS.16 92.71,13.62 SW1.1 SW1.2 95.25,21.17 C5.1 | v94.93,35.88 94.93,34.29 v90.49,29.84
OUT2  (via drill 0.38)
  Top 0.406: SW2.1 81.92,19.68 81.92,28.16 R12.2 82.23,29.21 v81.6,29.84 | U2.7 85.42,36.51 v86.04,35.88 | SW9.2 43.81,9.53 45.72,8.89 82.31,8.89 83.58,7.62 OUTPUTS.13
  Bottom 0.406: OUTPUTS.13 83.58,9.48 OUTPUTS.14 83.82,14.24 SW2.1 SW2.2 86.36,21.17 C7.1 | v86.04,35.88 86.04,34.29 v81.6,29.84
OUT3  (via drill 0.38)
  Top 0.406: SW3.1 73.03,19.68 73.03,28.16 R19.2 73.34,29.21 v72.71,29.84 | U3.7 76.53,36.51 v77.15,35.88 | SW9.3 41.27,9.53 44.45,6.35 50.16,6.35 52.07,4.45 76.04,4.45 OUTPUTS.11
  Bottom 0.406: OUTPUTS.11 78.58,9.48 OUTPUTS.12 77.47,15.6 SW3.2 | SW3.2 77.47,21.17 C9.1 | v77.15,35.88 77.15,34.29 v72.71,29.84 | SW3.1 SW3.2
OUT4  (via drill 0.38)
  Top 0.406: U4.7 67.64,36.51 v68.26,35.88 | v63.82,29.84 64.45,29.21 R26.2 64.14,28.16 64.14,19.68 SW4.1 64.14,15.88 57.78,15.88 56.52,14.61 49.53,14.61 48.26,13.34 40.01,13.34 38.73,12.06 SW9.4
  Bottom 0.406: OUTPUTS.9 73.34,9.48 OUTPUTS.10 70.05,17.78 SW4.2 | SW4.2 68.58,21.17 C11.1 | v68.26,35.88 68.26,34.29 v63.82,29.84 | SW4.1 SW4.2
OUT5  (via drill 0.38)
  Top 0.406: U5.7 58.74,36.51 v59.37,35.88 | v54.93,29.84 55.56,29.21 R33.2 55.24,28.16 55.24,19.68 SW5.1 55.24,15.88 48.9,15.88 47.62,14.61 37.47,14.61 36.2,13.34 SW9.5
  Bottom 0.406: OUTPUTS.7 68.34,9.48 OUTPUTS.8 68.86,13.97 66.67,13.97 62.87,17.78 SW5.2 | SW5.2 59.69,21.17 C13.1 | v59.37,35.88 59.37,34.29 v54.93,29.84 | SW5.1 SW5.2
OUT6  (via drill 0.38)
  Top 0.406: U6.7 49.85,36.51 v50.48,35.88 | v45.72,29.84 46.35,29.21 R40.2 46.35,28.16 46.35,19.68 SW6.1 46.35,15.88 36.2,15.88 33.66,13.34 SW9.6
  Bottom 0.406: OUTPUTS.5 63.34,9.48 OUTPUTS.6 62.59,15.24 53.34,15.24 SW6.2 | SW6.2 50.8,21.17 C15.1 | v50.48,35.88 50.48,34.61 v45.72,29.84 | SW6.1 SW6.2
OUT7  (via drill 0.38)
  Top 0.406: U7.7 40.97,36.51 v41.59,35.88 | v37.15,29.84 37.78,29.21 R47.2 37.47,28.16 37.47,19.68 SW7.1 36.2,17.78 31.11,12.7 SW9.7
  Bottom 0.406: OUTPUTS.3 58.34,9.48 OUTPUTS.4 58.85,13.97 45.72,13.97 SW7.2 | SW7.2 41.91,21.17 C17.1 | v41.59,35.88 41.59,34.29 v37.15,29.84 | SW7.1 SW7.2
OUT8  (via drill 0.38)
  Top 0.406: SW8.1 28.57,19.68 28.57,28.16 R54.2 28.57,29.21 v27.94,29.84 | U8.7 32.08,36.51 v32.7,35.88
  Bottom 0.406: OUTPUTS.1 53.34,9.48 OUTPUTS.2 55.12,12.7 45.09,12.7 43.81,13.97 36.2,13.97 33.02,17.14 SW8.2 | SW8.2 33.02,21.17 C19.1 | v32.7,35.88 32.7,34.61 v27.94,29.84 | SW8.2 SW8.1 28.57,15.88 SW9.8
SG_1
  Top 0.406: TRIM_1.2 97.79,55.88 97.79,46.04 94.31,42.55 U1.2
  Bottom 0.406: SG_CONN.2 88.27,68.06 88.27,62.23 90.81,59.69 TRIM_1.2
  Bottom 0.61: SG_CONN.1 87.03,71.8 SG_CONN.2
SG_2
  Top 0.406: TRIM_2.2 88.58,56.2 88.58,46.04 85.42,42.87 U2.2
  Bottom 0.406: SG_CONN.6 80.01,66.32 80.01,62.23 82.55,59.69 TRIM_2.2
  Bottom 0.61: SG_CONN.5 77.03,71.8 SG_CONN.6
SG_3
  Top 0.406: TRIM_3.2 79.69,56.2 79.69,45.72 76.53,42.55 U3.2
  Bottom 0.406: SG_CONN.10 70.48,65.84 70.48,62.23 73.03,59.69 TRIM_3.2
  Bottom 0.61: SG_CONN.9 67.03,71.8 SG_CONN.10
SG_4
  Top 0.406: TRIM_4.2 71.12,55.88 71.12,46.04 67.64,42.55 U4.2
  Bottom 0.406: SG_CONN.14 62.23,64.1 62.23,61.59 64.14,59.69 TRIM_4.2
  Bottom 0.61: SG_CONN.13 57.03,71.8 SG_CONN.14
SG_5
  Top 0.406: TRIM_5.2 62.23,55.88 62.23,46.35 58.74,42.87 U5.2
  Bottom 0.406: SG_CONN.18 56.64,59.69 TRIM_5.2
  Bottom 0.61: SG_CONN.17 47.03,71.8 SG_CONN.18
SG_6
  Top 0.406: U6.2 49.85,42.87 53.02,46.04 53.02,56.2 TRIM_6.2
  Top 0.61: 48.9,59.69 TRIM_6.2
  Bottom 0.406: SG_CONN.22 46.64,59.69 TRIM_6.2
  Bottom 0.61: SG_CONN.21 37.03,71.8 SG_CONN.22
SG_7
  Top 0.406: TRIM_7.2 44.13,56.2 44.13,46.35 40.97,43.19 U7.2
  Bottom 0.406: SG_CONN.26 36.64,59.69 TRIM_7.2
  Bottom 0.61: SG_CONN.25 27.04,71.8 SG_CONN.26
SG_8
  Top 0.406: TRIM_8.2 35.24,56.2 35.24,46.04 32.08,42.87 U8.2
  Bottom 0.406: SG_CONN.30 26.64,59.69 TRIM_8.2
  Bottom 0.61: SG_CONN.29 17.04,71.8 SG_CONN.30
UPP_V  (via drill 0.6)
  Top 0.406: IC1.5 18.03,9.78 v18.73,10.48 | v26.04,20.95 R60.2 R59.1
  Bottom 0.406: v18.73,10.48 19.05,10.48 26.04,17.46 v26.04,20.95

### Text on the board
tNames: 8 | 1 | FUSE_5V | FUSE_10V | OFFSET ADJ. INDICATOR | OFFSET ADJ. SELECTION -->
bNames: Cal Poly SAE 8-ch Strain Gauge Amplifier / Designed By: Thomas E. Willson / (thomas.willson@me.com) / Date: Oct.2014 / Rev: 1 / / Supply Voltage: 12V / Output Voltage: 0-10V